# Altium schematic sheet SWITCHING (CONT).SchDoc
size 420 x 297 mm; SheetNumber: 7; SheetTotal: 7
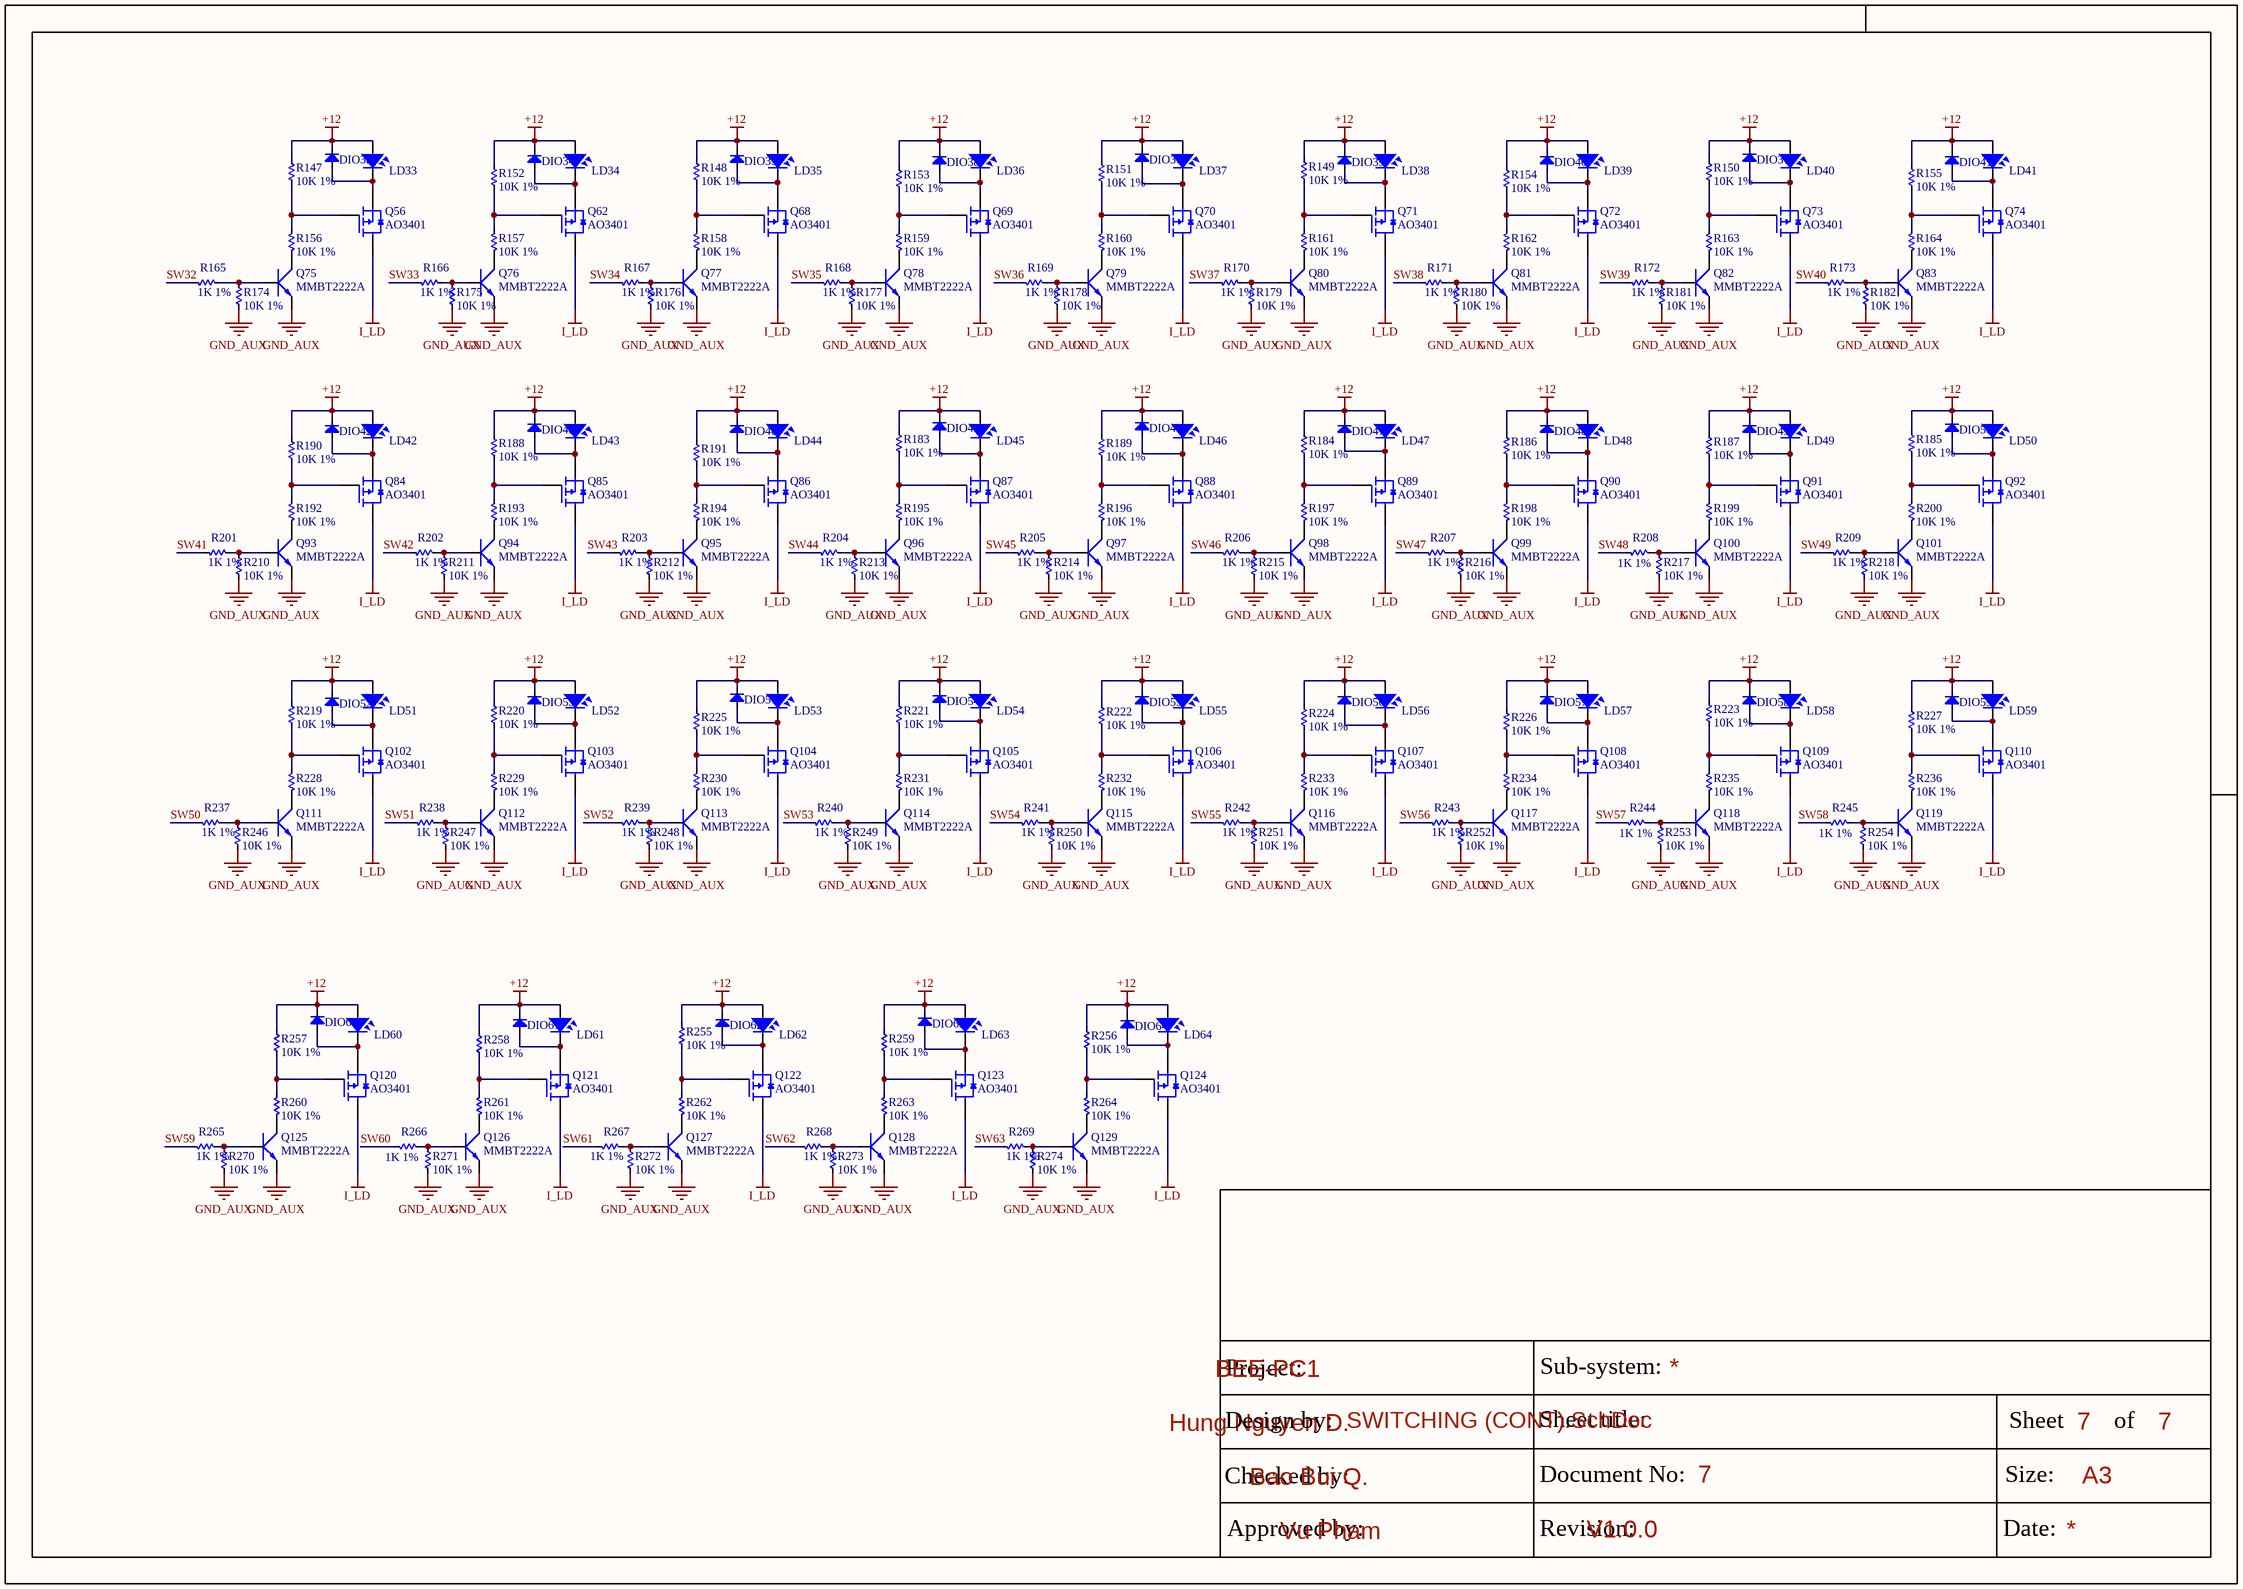
[diagram p0: SWITCHING (CONT).SchDoc]

## Parts
DIO33  Diode SMD  [SOD23]  (value not drawn)
DIO34  Diode SMD  [SOD23]  (value not drawn)
DIO35  Diode SMD  [SOD23]  (value not drawn)
DIO36  Diode SMD  [SOD23]  (value not drawn)
DIO37  Diode SMD  [SOD23]  (value not drawn)
DIO38  Diode SMD  [SOD23]  (value not drawn)
DIO39  Diode SMD  [SOD23]  (value not drawn)
DIO40  Diode SMD  [SOD23]  (value not drawn)
DIO41  Diode SMD  [SOD23]  (value not drawn)
DIO42  Diode SMD  [SOD23]  (value not drawn)
DIO43  Diode SMD  [SOD23]  (value not drawn)
DIO44  Diode SMD  [SOD23]  (value not drawn)
DIO45  Diode SMD  [SOD23]  (value not drawn)
DIO46  Diode SMD  [SOD23]  (value not drawn)
DIO47  Diode SMD  [SOD23]  (value not drawn)
DIO48  Diode SMD  [SOD23]  (value not drawn)
DIO49  Diode SMD  [SOD23]  (value not drawn)
DIO50  Diode SMD  [SOD23]  (value not drawn)
DIO51  Diode SMD  [SOD23]  (value not drawn)
DIO52  Diode SMD  [SOD23]  (value not drawn)
DIO53  Diode SMD  [SOD23]  (value not drawn)
DIO54  Diode SMD  [SOD23]  (value not drawn)
DIO55  Diode SMD  [SOD23]  (value not drawn)
DIO56  Diode SMD  [SOD23]  (value not drawn)
DIO57  Diode SMD  [SOD23]  (value not drawn)
DIO58  Diode SMD  [SOD23]  (value not drawn)
DIO59  Diode SMD  [SOD23]  (value not drawn)
DIO60  Diode SMD  [SOD23]  (value not drawn)
DIO61  Diode SMD  [SOD23]  (value not drawn)
DIO62  Diode SMD  [SOD23]  (value not drawn)
DIO63  Diode SMD  [SOD23]  (value not drawn)
DIO64  Diode SMD  [SOD23]  (value not drawn)
LD33  LaserDiode  [LASER]  (value not drawn)
LD34  LaserDiode  [LASER]  (value not drawn)
LD35  LaserDiode  [LASER]  (value not drawn)
LD36  LaserDiode  [LASER]  (value not drawn)
LD37  LaserDiode  [LASER]  (value not drawn)
LD38  LaserDiode  [LASER]  (value not drawn)
LD39  LaserDiode  [LASER]  (value not drawn)
LD40  LaserDiode  [LASER]  (value not drawn)
LD41  LaserDiode  [LASER]  (value not drawn)
LD42  LaserDiode  [LASER]  (value not drawn)
LD43  LaserDiode  [LASER]  (value not drawn)
LD44  LaserDiode  [LASER]  (value not drawn)
LD45  LaserDiode  [LASER]  (value not drawn)
LD46  LaserDiode  [LASER]  (value not drawn)
LD47  LaserDiode  [LASER]  (value not drawn)
LD48  LaserDiode  [LASER]  (value not drawn)
LD49  LaserDiode  [LASER]  (value not drawn)
LD50  LaserDiode  [LASER]  (value not drawn)
LD51  LaserDiode  [LASER]  (value not drawn)
LD52  LaserDiode  [LASER]  (value not drawn)
LD53  LaserDiode  [LASER]  (value not drawn)
LD54  LaserDiode  [LASER]  (value not drawn)
LD55  LaserDiode  [LASER]  (value not drawn)
LD56  LaserDiode  [LASER]  (value not drawn)
LD57  LaserDiode  [LASER]  (value not drawn)
LD58  LaserDiode  [LASER]  (value not drawn)
LD59  LaserDiode  [LASER]  (value not drawn)
LD60  LaserDiode  [LASER]  (value not drawn)
LD61  LaserDiode  [LASER]  (value not drawn)
LD62  LaserDiode  [LASER]  (value not drawn)
LD63  LaserDiode  [LASER]  (value not drawn)
LD64  LaserDiode  [LASER]  (value not drawn)
Q56  AO3401  [SOT23-123]
Q62  AO3401  [SOT23-123]
Q68  AO3401  [SOT23-123]
Q69  AO3401  [SOT23-123]
Q70  AO3401  [SOT23-123]
Q71  AO3401  [SOT23-123]
Q72  AO3401  [SOT23-123]
Q73  AO3401  [SOT23-123]
Q74  AO3401  [SOT23-123]
Q75  MMBT2222A  [SOT23-132]
Q76  MMBT2222A  [SOT23-132]
Q77  MMBT2222A  [SOT23-132]
Q78  MMBT2222A  [SOT23-132]
Q79  MMBT2222A  [SOT23-132]
Q80  MMBT2222A  [SOT23-132]
Q81  MMBT2222A  [SOT23-132]
Q82  MMBT2222A  [SOT23-132]
Q83  MMBT2222A  [SOT23-132]
Q84  AO3401  [SOT23-123]
Q85  AO3401  [SOT23-123]
Q86  AO3401  [SOT23-123]
Q87  AO3401  [SOT23-123]
Q88  AO3401  [SOT23-123]
Q89  AO3401  [SOT23-123]
Q90  AO3401  [SOT23-123]
Q91  AO3401  [SOT23-123]
Q92  AO3401  [SOT23-123]
Q93  MMBT2222A  [SOT23-132]
Q94  MMBT2222A  [SOT23-132]
Q95  MMBT2222A  [SOT23-132]
Q96  MMBT2222A  [SOT23-132]
Q97  MMBT2222A  [SOT23-132]
Q98  MMBT2222A  [SOT23-132]
Q99  MMBT2222A  [SOT23-132]
Q100  MMBT2222A  [SOT23-132]
Q101  MMBT2222A  [SOT23-132]
Q102  AO3401  [SOT23-123]
Q103  AO3401  [SOT23-123]
Q104  AO3401  [SOT23-123]
Q105  AO3401  [SOT23-123]
Q106  AO3401  [SOT23-123]
Q107  AO3401  [SOT23-123]
Q108  AO3401  [SOT23-123]
Q109  AO3401  [SOT23-123]
Q110  AO3401  [SOT23-123]
Q111  MMBT2222A  [SOT23-132]
Q112  MMBT2222A  [SOT23-132]
Q113  MMBT2222A  [SOT23-132]
Q114  MMBT2222A  [SOT23-132]
Q115  MMBT2222A  [SOT23-132]
Q116  MMBT2222A  [SOT23-132]
Q117  MMBT2222A  [SOT23-132]
Q118  MMBT2222A  [SOT23-132]
Q119  MMBT2222A  [SOT23-132]
Q120  AO3401  [SOT23-123]
Q121  AO3401  [SOT23-123]
Q122  AO3401  [SOT23-123]
Q123  AO3401  [SOT23-123]
Q124  AO3401  [SOT23-123]
Q125  MMBT2222A  [SOT23-132]
Q126  MMBT2222A  [SOT23-132]
Q127  MMBT2222A  [SOT23-132]
Q128  MMBT2222A  [SOT23-132]
Q129  MMBT2222A  [SOT23-132]
R147  10K 1%  [RES-SMD-0603]
R148  10K 1%  [RES-SMD-0603]
R149  10K 1%  [RES-SMD-0603]
R150  10K 1%  [RES-SMD-0603]
R151  10K 1%  [RES-SMD-0603]
R152  10K 1%  [RES-SMD-0603]
R153  10K 1%  [RES-SMD-0603]
R154  10K 1%  [RES-SMD-0603]
R155  10K 1%  [RES-SMD-0603]
R156  10K 1%  [RES-SMD-0603]
R157  10K 1%  [RES-SMD-0603]
R158  10K 1%  [RES-SMD-0603]
R159  10K 1%  [RES-SMD-0603]
R160  10K 1%  [RES-SMD-0603]
R161  10K 1%  [RES-SMD-0603]
R162  10K 1%  [RES-SMD-0603]
R163  10K 1%  [RES-SMD-0603]
R164  10K 1%  [RES-SMD-0603]
R165  1K 1%  [RES-SMD-0603]
R166  1K 1%  [RES-SMD-0603]
R167  1K 1%  [RES-SMD-0603]
R168  1K 1%  [RES-SMD-0603]
R169  1K 1%  [RES-SMD-0603]
R170  1K 1%  [RES-SMD-0603]
R171  1K 1%  [RES-SMD-0603]
R172  1K 1%  [RES-SMD-0603]
R173  1K 1%  [RES-SMD-0603]
R174  10K 1%  [RES-SMD-0603]
R175  10K 1%  [RES-SMD-0603]
R176  10K 1%  [RES-SMD-0603]
R177  10K 1%  [RES-SMD-0603]
R178  10K 1%  [RES-SMD-0603]
R179  10K 1%  [RES-SMD-0603]
R180  10K 1%  [RES-SMD-0603]
R181  10K 1%  [RES-SMD-0603]
R182  10K 1%  [RES-SMD-0603]
R183  10K 1%  [RES-SMD-0603]
R184  10K 1%  [RES-SMD-0603]
R185  10K 1%  [RES-SMD-0603]
R186  10K 1%  [RES-SMD-0603]
R187  10K 1%  [RES-SMD-0603]
R188  10K 1%  [RES-SMD-0603]
R189  10K 1%  [RES-SMD-0603]
R190  10K 1%  [RES-SMD-0603]
R191  10K 1%  [RES-SMD-0603]
R192  10K 1%  [RES-SMD-0603]
R193  10K 1%  [RES-SMD-0603]
R194  10K 1%  [RES-SMD-0603]
R195  10K 1%  [RES-SMD-0603]
R196  10K 1%  [RES-SMD-0603]
R197  10K 1%  [RES-SMD-0603]
R198  10K 1%  [RES-SMD-0603]
R199  10K 1%  [RES-SMD-0603]
R200  10K 1%  [RES-SMD-0603]
R201  1K 1%  [RES-SMD-0603]
R202  1K 1%  [RES-SMD-0603]
R203  1K 1%  [RES-SMD-0603]
R204  1K 1%  [RES-SMD-0603]
R205  1K 1%  [RES-SMD-0603]
R206  1K 1%  [RES-SMD-0603]
R207  1K 1%  [RES-SMD-0603]
R208  1K 1%  [RES-SMD-0603]
R209  1K 1%  [RES-SMD-0603]
R210  10K 1%  [RES-SMD-0603]
R211  10K 1%  [RES-SMD-0603]
R212  10K 1%  [RES-SMD-0603]
R213  10K 1%  [RES-SMD-0603]
R214  10K 1%  [RES-SMD-0603]
R215  10K 1%  [RES-SMD-0603]
R216  10K 1%  [RES-SMD-0603]
R217  10K 1%  [RES-SMD-0603]
R218  10K 1%  [RES-SMD-0603]
R219  10K 1%  [RES-SMD-0603]
R220  10K 1%  [RES-SMD-0603]
R221  10K 1%  [RES-SMD-0603]
R222  10K 1%  [RES-SMD-0603]
R223  10K 1%  [RES-SMD-0603]
R224  10K 1%  [RES-SMD-0603]
R225  10K 1%  [RES-SMD-0603]
R226  10K 1%  [RES-SMD-0603]
R227  10K 1%  [RES-SMD-0603]
R228  10K 1%  [RES-SMD-0603]
R229  10K 1%  [RES-SMD-0603]
R230  10K 1%  [RES-SMD-0603]
R231  10K 1%  [RES-SMD-0603]
R232  10K 1%  [RES-SMD-0603]
R233  10K 1%  [RES-SMD-0603]
R234  10K 1%  [RES-SMD-0603]
R235  10K 1%  [RES-SMD-0603]
R236  10K 1%  [RES-SMD-0603]
R237  1K 1%  [RES-SMD-0603]
R238  1K 1%  [RES-SMD-0603]
R239  1K 1%  [RES-SMD-0603]
R240  1K 1%  [RES-SMD-0603]
R241  1K 1%  [RES-SMD-0603]
R242  1K 1%  [RES-SMD-0603]
R243  1K 1%  [RES-SMD-0603]
R244  1K 1%  [RES-SMD-0603]
R245  1K 1%  [RES-SMD-0603]
R246  10K 1%  [RES-SMD-0603]
R247  10K 1%  [RES-SMD-0603]
R248  10K 1%  [RES-SMD-0603]
R249  10K 1%  [RES-SMD-0603]
R250  10K 1%  [RES-SMD-0603]
R251  10K 1%  [RES-SMD-0603]
R252  10K 1%  [RES-SMD-0603]
R253  10K 1%  [RES-SMD-0603]
R254  10K 1%  [RES-SMD-0603]
R255  10K 1%  [RES-SMD-0603]
R256  10K 1%  [RES-SMD-0603]
R257  10K 1%  [RES-SMD-0603]
R258  10K 1%  [RES-SMD-0603]
R259  10K 1%  [RES-SMD-0603]
R260  10K 1%  [RES-SMD-0603]
R261  10K 1%  [RES-SMD-0603]
R262  10K 1%  [RES-SMD-0603]
R263  10K 1%  [RES-SMD-0603]
R264  10K 1%  [RES-SMD-0603]
R265  1K 1%  [RES-SMD-0603]
R266  1K 1%  [RES-SMD-0603]
R267  1K 1%  [RES-SMD-0603]
R268  1K 1%  [RES-SMD-0603]
R269  1K 1%  [RES-SMD-0603]
R270  10K 1%  [RES-SMD-0603]
R271  10K 1%  [RES-SMD-0603]
R272  10K 1%  [RES-SMD-0603]
R273  10K 1%  [RES-SMD-0603]
R274  10K 1%  [RES-SMD-0603]

## Nets
+12: DIO33.2(K) DIO34.2(K) DIO35.2(K) DIO36.2(K) DIO37.2(K) DIO38.2(K) DIO39.2(K) DIO40.2(K) DIO41.2(K) DIO42.2(K) DIO43.2(K) DIO44.2(K) DIO45.2(K) DIO46.2(K) DIO47.2(K) DIO48.2(K) DIO49.2(K) DIO50.2(K) DIO51.2(K) DIO52.2(K) DIO53.2(K) DIO54.2(K) DIO55.2(K) DIO56.2(K) DIO57.2(K) DIO58.2(K) DIO59.2(K) DIO60.2(K) DIO61.2(K) DIO62.2(K) DIO63.2(K) DIO64.2(K) LD33.1 LD34.1 LD35.1 LD36.1 LD37.1 LD38.1 LD39.1 LD40.1 LD41.1 LD42.1 LD43.1 LD44.1 LD45.1 LD46.1 LD47.1 LD48.1 LD49.1 LD50.1 LD51.1 LD52.1 LD53.1 LD54.1 LD55.1 LD56.1 LD57.1 LD58.1 LD59.1 LD60.1 LD61.1 LD62.1 LD63.1 LD64.1 R147.1 R148.1 R149.1 R150.1 R151.1 R152.1 R153.1 R154.1 R155.1 R183.1 R184.1 R185.1 R186.1 R187.1 R188.1 R189.1 R190.1 R191.1 R219.1 R220.1 R221.1 R222.1 R223.1 R224.1 R225.1 R226.1 R227.1 R255.1 R256.1 R257.1 R258.1 R259.1
GND_AUX: Q75.2(E) Q76.2(E) Q77.2(E) Q78.2(E) Q79.2(E) Q80.2(E) Q81.2(E) Q82.2(E) Q83.2(E) Q93.2(E) Q94.2(E) Q95.2(E) Q96.2(E) Q97.2(E) Q98.2(E) Q99.2(E) Q100.2(E) Q101.2(E) Q111.2(E) Q112.2(E) Q113.2(E) Q114.2(E) Q115.2(E) Q116.2(E) Q117.2(E) Q118.2(E) Q119.2(E) Q125.2(E) Q126.2(E) Q127.2(E) Q128.2(E) Q129.2(E) R174.2 R175.2 R176.2 R177.2 R178.2 R179.2 R180.2 R181.2 R182.2 R210.2 R211.2 R212.2 R213.2 R214.2 R215.2 R216.2 R217.2 R218.2 R246.2 R247.2 R248.2 R249.2 R250.2 R251.2 R252.2 R253.2 R254.2 R270.2 R271.2 R272.2 R273.2 R274.2
I_LD: Q56.2 Q62.2 Q68.2 Q69.2 Q70.2 Q71.2 Q72.2 Q73.2 Q74.2 Q84.2 Q85.2 Q86.2 Q87.2 Q88.2 Q89.2 Q90.2 Q91.2 Q92.2 Q102.2 Q103.2 Q104.2 Q105.2 Q106.2 Q107.2 Q108.2 Q109.2 Q110.2 Q120.2 Q121.2 Q122.2 Q123.2 Q124.2
SW32: R165.1
SW33: R166.1
SW34: R167.1
SW35: R168.1
SW36: R169.1
SW37: R170.1
SW38: R171.1
SW39: R172.1
SW40: R173.1
SW41: R201.1
SW42: R202.1
SW43: R203.1
SW44: R204.1
SW45: R205.1
SW46: R206.1
SW47: R207.1
SW48: R208.1
SW49: R209.1
SW50: R237.1
SW51: R238.1
SW52: R239.1
SW53: R240.1
SW54: R241.1
SW55: R242.1
SW56: R243.1
SW57: R244.1
SW58: R245.1
SW59: R265.1
SW60: R266.1
SW61: R267.1
SW62: R268.1
SW63: R269.1
NetDIO33_1: DIO33.1(A) LD33.3 Q56.3
NetDIO34_1: DIO34.1(A) LD34.3 Q62.3
NetDIO35_1: DIO35.1(A) LD35.3 Q68.3
NetDIO36_1: DIO36.1(A) LD37.3 Q70.3
NetDIO37_1: DIO37.1(A) LD40.3 Q73.3
NetDIO38_1: DIO38.1(A) LD36.3 Q69.3
NetDIO39_1: DIO39.1(A) LD38.3 Q71.3
NetDIO40_1: DIO40.1(A) LD39.3 Q72.3
NetDIO41_1: DIO41.1(A) LD41.3 Q74.3
NetDIO42_1: DIO42.1(A) LD42.3 Q84.3
NetDIO43_1: DIO43.1(A) LD43.3 Q85.3
NetDIO44_1: DIO44.1(A) LD45.3 Q87.3
NetDIO45_1: DIO45.1(A) LD46.3 Q88.3
NetDIO46_1: DIO46.1(A) LD44.3 Q86.3
NetDIO47_1: DIO47.1(A) LD47.3 Q89.3
NetDIO48_1: DIO48.1(A) LD48.3 Q90.3
NetDIO49_1: DIO49.1(A) LD49.3 Q91.3
NetDIO50_1: DIO50.1(A) LD50.3 Q92.3
NetDIO51_1: DIO51.1(A) LD53.3 Q104.3
NetDIO52_1: DIO52.1(A) LD51.3 Q102.3
NetDIO53_1: DIO53.1(A) LD52.3 Q103.3
NetDIO54_1: DIO54.1(A) LD54.3 Q105.3
NetDIO55_1: DIO55.1(A) LD55.3 Q106.3
NetDIO56_1: DIO56.1(A) LD56.3 Q107.3
NetDIO57_1: DIO57.1(A) LD57.3 Q108.3
NetDIO58_1: DIO58.1(A) LD58.3 Q109.3
NetDIO59_1: DIO59.1(A) LD59.3 Q110.3
NetDIO60_1: DIO60.1(A) LD60.3 Q120.3
NetDIO61_1: DIO61.1(A) LD61.3 Q121.3
NetDIO62_1: DIO62.1(A) LD62.3 Q122.3
NetDIO63_1: DIO63.1(A) LD63.3 Q123.3
NetDIO64_1: DIO64.1(A) LD64.3 Q124.3
NetQ56_1: Q56.1 R147.2 R156.2
NetQ62_1: Q62.1 R152.2 R157.2
NetQ68_1: Q68.1 R148.2 R158.2
NetQ69_1: Q69.1 R153.2 R159.2
NetQ70_1: Q70.1 R151.2 R160.2
NetQ71_1: Q71.1 R149.2 R161.2
NetQ72_1: Q72.1 R154.2 R162.2
NetQ73_1: Q73.1 R150.2 R163.2
NetQ74_1: Q74.1 R155.2 R164.2
NetQ75_1: Q75.1(B) R165.2 R174.1
NetQ75_3: Q75.3(C) R156.1
NetQ76_1: Q76.1(B) R166.2 R175.1
NetQ76_3: Q76.3(C) R157.1
NetQ77_1: Q77.1(B) R167.2 R176.1
NetQ77_3: Q77.3(C) R158.1
NetQ78_1: Q78.1(B) R168.2 R177.1
NetQ78_3: Q78.3(C) R159.1
NetQ79_1: Q79.1(B) R169.2 R178.1
NetQ79_3: Q79.3(C) R160.1
NetQ80_1: Q80.1(B) R170.2 R179.1
NetQ80_3: Q80.3(C) R161.1
NetQ81_1: Q81.1(B) R171.2 R180.1
NetQ81_3: Q81.3(C) R162.1
NetQ82_1: Q82.1(B) R172.2 R181.1
NetQ82_3: Q82.3(C) R163.1
NetQ83_1: Q83.1(B) R173.2 R182.1
NetQ83_3: Q83.3(C) R164.1
NetQ84_1: Q84.1 R190.2 R192.2
NetQ85_1: Q85.1 R188.2 R193.2
NetQ86_1: Q86.1 R191.2 R194.2
NetQ87_1: Q87.1 R183.2 R195.2
NetQ88_1: Q88.1 R189.2 R196.2
NetQ89_1: Q89.1 R184.2 R197.2
NetQ90_1: Q90.1 R186.2 R198.2
NetQ91_1: Q91.1 R187.2 R199.2
NetQ92_1: Q92.1 R185.2 R200.2
NetQ93_1: Q93.1(B) R201.2 R210.1
NetQ93_3: Q93.3(C) R192.1
NetQ94_1: Q94.1(B) R202.2 R211.1
NetQ94_3: Q94.3(C) R193.1
NetQ95_1: Q95.1(B) R203.2 R212.1
NetQ95_3: Q95.3(C) R194.1
NetQ96_1: Q96.1(B) R204.2 R213.1
NetQ96_3: Q96.3(C) R195.1
NetQ97_1: Q97.1(B) R205.2 R214.1
NetQ97_3: Q97.3(C) R196.1
NetQ98_1: Q98.1(B) R206.2 R215.1
NetQ98_3: Q98.3(C) R197.1
NetQ99_1: Q99.1(B) R207.2 R216.1
NetQ99_3: Q99.3(C) R198.1
NetQ100_1: Q100.1(B) R208.2 R217.1
NetQ100_3: Q100.3(C) R199.1
NetQ101_1: Q101.1(B) R209.2 R218.1
NetQ101_3: Q101.3(C) R200.1
NetQ102_1: Q102.1 R219.2 R228.2
NetQ103_1: Q103.1 R220.2 R229.2
NetQ104_1: Q104.1 R225.2 R230.2
NetQ105_1: Q105.1 R221.2 R231.2
NetQ106_1: Q106.1 R222.2 R232.2
NetQ107_1: Q107.1 R224.2 R233.2
NetQ108_1: Q108.1 R226.2 R234.2
NetQ109_1: Q109.1 R223.2 R235.2
NetQ110_1: Q110.1 R227.2 R236.2
NetQ111_1: Q111.1(B) R237.2 R246.1
NetQ111_3: Q111.3(C) R228.1
NetQ112_1: Q112.1(B) R238.2 R247.1
NetQ112_3: Q112.3(C) R229.1
NetQ113_1: Q113.1(B) R239.2 R248.1
NetQ113_3: Q113.3(C) R230.1
NetQ114_1: Q114.1(B) R240.2 R249.1
NetQ114_3: Q114.3(C) R231.1
NetQ115_1: Q115.1(B) R241.2 R250.1
NetQ115_3: Q115.3(C) R232.1
NetQ116_1: Q116.1(B) R242.2 R251.1
NetQ116_3: Q116.3(C) R233.1
NetQ117_1: Q117.1(B) R243.2 R252.1
NetQ117_3: Q117.3(C) R234.1
NetQ118_1: Q118.1(B) R244.2 R253.1
NetQ118_3: Q118.3(C) R235.1
NetQ119_1: Q119.1(B) R245.2 R254.1
NetQ119_3: Q119.3(C) R236.1
NetQ120_1: Q120.1 R257.2 R260.2
NetQ121_1: Q121.1 R258.2 R261.2
NetQ122_1: Q122.1 R255.2 R262.2
NetQ123_1: Q123.1 R259.2 R263.2
NetQ124_1: Q124.1 R256.2 R264.2
NetQ125_1: Q125.1(B) R265.2 R270.1
NetQ125_3: Q125.3(C) R260.1
NetQ126_1: Q126.1(B) R266.2 R271.1
NetQ126_3: Q126.3(C) R261.1
NetQ127_1: Q127.1(B) R267.2 R272.1
NetQ127_3: Q127.3(C) R262.1
NetQ128_1: Q128.1(B) R268.2 R273.1
NetQ128_3: Q128.3(C) R263.1
NetQ129_1: Q129.1(B) R269.2 R274.1
NetQ129_3: Q129.3(C) R264.1

## Notes on the sheet
- Project:
- BEE-PC1
- Sub-system:
- Design by:
- Hung Nguyen D.
- Bao Bui Q.
- Sheet title:
- Sheet
- A3
- of
- Checked by:
- Approved by:
- Vu Pham
- Revision:
- Document No:
- V1.0.0
- Size:
- Date:

## Library data of the parts
DIO33-DIO64 = Diode SMD: Default Diode; Code - JEDEC: DO-214-AB; Value: 1N5007; Published: 8-Jun-2000; Revision: July-2002: Re-released for DXP Platform.; Publisher: Altium Limited
LD33-LD64 = LD
Q56 Q62 Q68-Q74 Q84-Q92 Q102-Q110 Q120-Q124 = FET-P
Q75-Q83 Q93-Q101 Q111-Q119 Q125-Q129 = 2SC1815: SOT23-3; Value: C1815
R147-R274 = Res-SMD: 0603; Manufacturer: Generic Components; Class: Passive; Published: 08/06/2000; Publisher: Altium Hobart Technology Centre